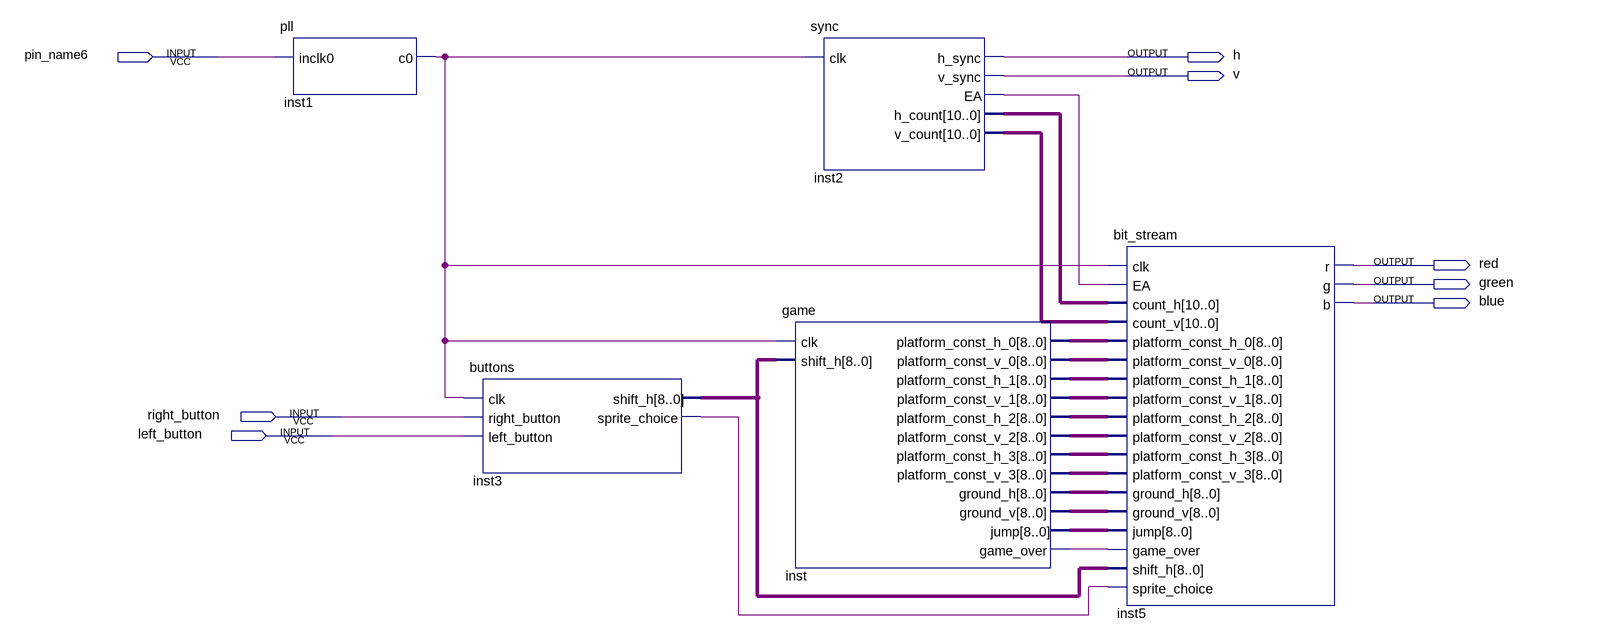
[diagram p0: schematic sheet]
// Quartus schematic test.bdf as structural Verilog: 5 symbols, 8 pins
module test (
  input  pin_name6,
  input  right_button,
  input  left_button,
  output h,
  output v,
  output red,
  output green,
  output blue
);

  wire inst1_c0, inst2_ea, inst3_sprite_choice, inst_game_over;
  wire [8:0] inst3_shift_h, inst_ground_h, inst_ground_v, inst_jump, inst_platform_const_h_0,
       inst_platform_const_h_1, inst_platform_const_h_2, inst_platform_const_h_3, inst_platform_const_v_0,
       inst_platform_const_v_1, inst_platform_const_v_2, inst_platform_const_v_3;
  wire [10:0] inst2_h_count, inst2_v_count;

  pll inst1 (.inclk0(pin_name6), .c0(inst1_c0));
  buttons inst3 (
    .clk(inst1_c0), .right_button(right_button), .left_button(left_button), .shift_h(inst3_shift_h),
    .sprite_choice(inst3_sprite_choice));
  game inst (
    .clk(inst1_c0), .shift_h(inst3_shift_h), .platform_const_h_0(inst_platform_const_h_0),
    .platform_const_v_0(inst_platform_const_v_0), .platform_const_h_1(inst_platform_const_h_1),
    .platform_const_v_1(inst_platform_const_v_1), .platform_const_h_2(inst_platform_const_h_2),
    .platform_const_v_2(inst_platform_const_v_2), .platform_const_h_3(inst_platform_const_h_3),
    .platform_const_v_3(inst_platform_const_v_3), .ground_h(inst_ground_h), .ground_v(inst_ground_v),
    .jump(inst_jump), .game_over(inst_game_over));
  sync inst2 (.clk(inst1_c0), .h_sync(h), .v_sync(v), .EA(inst2_ea), .h_count(inst2_h_count), .v_count(inst2_v_count));
  bit_stream inst5 (
    .clk(inst1_c0), .EA(inst2_ea), .count_h(inst2_h_count), .count_v(inst2_v_count),
    .platform_const_h_0(inst_platform_const_h_0), .platform_const_v_0(inst_platform_const_v_0),
    .platform_const_h_1(inst_platform_const_h_1), .platform_const_v_1(inst_platform_const_v_1),
    .platform_const_h_2(inst_platform_const_h_2), .platform_const_v_2(inst_platform_const_v_2),
    .platform_const_h_3(inst_platform_const_h_3), .platform_const_v_3(inst_platform_const_v_3),
    .ground_h(inst_ground_h), .ground_v(inst_ground_v), .jump(inst_jump), .game_over(inst_game_over),
    .shift_h(inst3_shift_h), .sprite_choice(inst3_sprite_choice), .r(red), .g(green), .b(blue));
endmodule
